# EAGLE schematic Tapuino 1.5 (EAGLE 7.1.0)
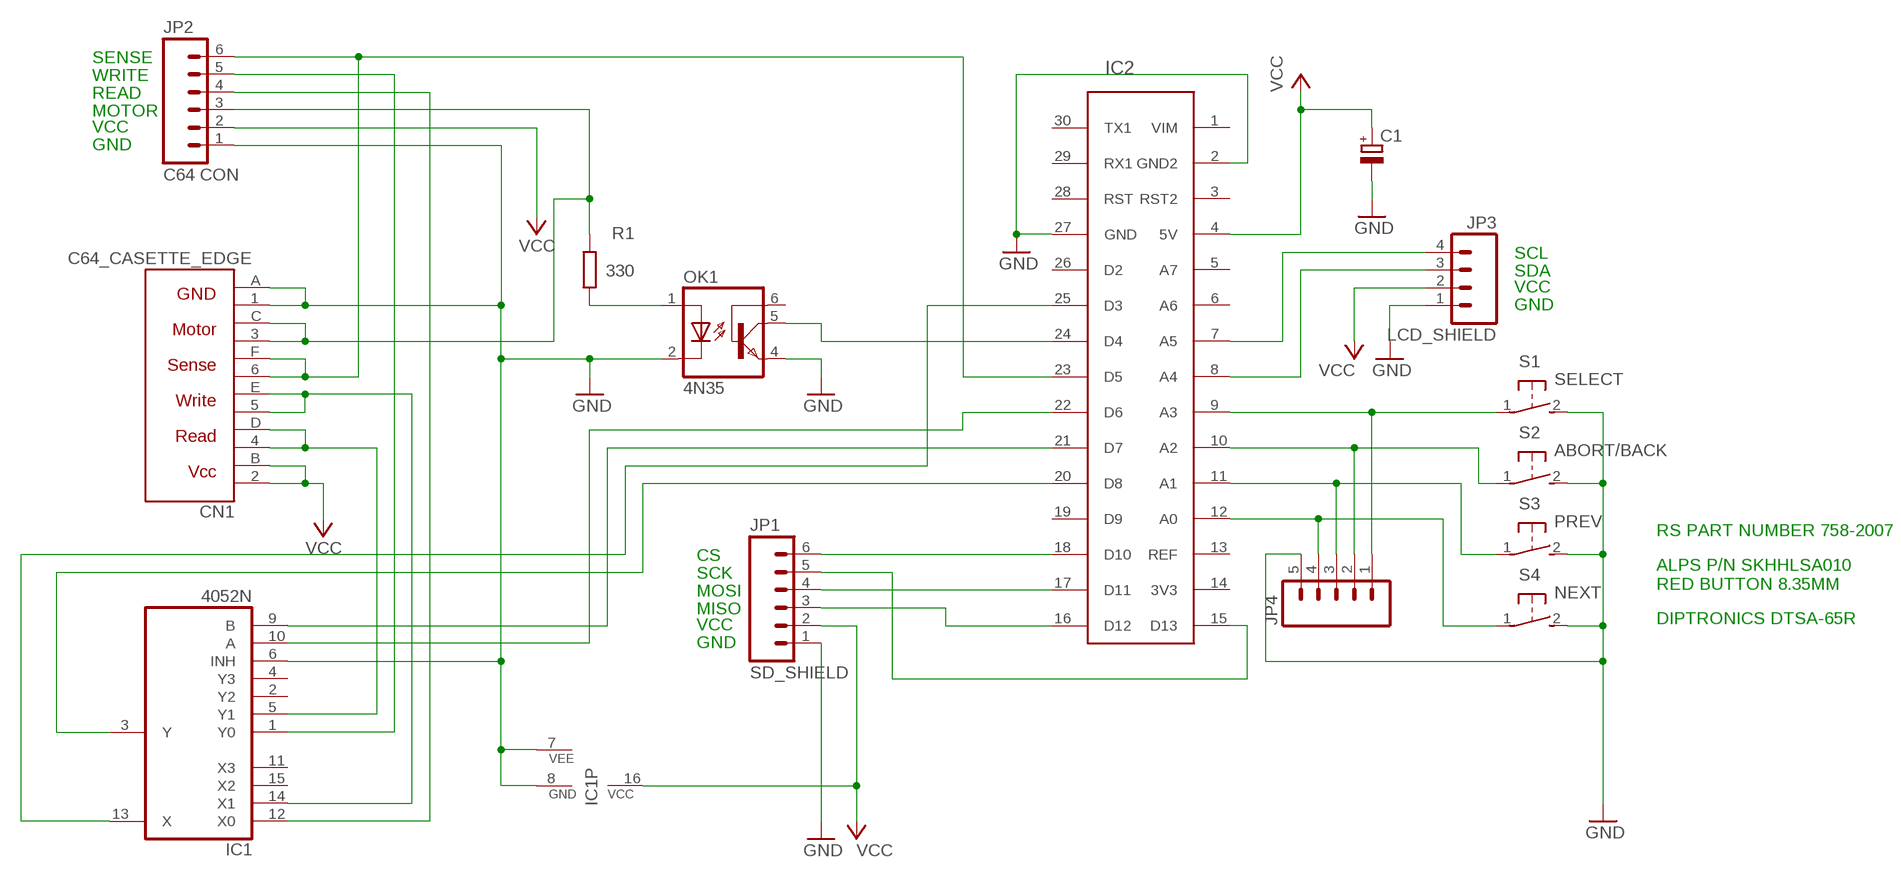
[diagram p0: schematic, sheet 1]

## Parts
C1  CPOL-EUE2.5-6  [E2,5-6]
CN1  C64_CASETTE_EDGE  [C64_CASSETTE]
IC1  4052N  [DIL16]
IC2  ARDUINO_NANO_V3  [NANO_V3]
JP1  SD_SHIELD  M06LOCK_LONGPADS  [1X06_LOCK_LONGPADS]
JP2  C64 CON  M06LOCK_LONGPADS  [1X06_LOCK_LONGPADS]
JP3  LCD_SHIELD  M04LOCK_LONGPADS  [1X04_LOCK_LONGPADS]
JP4  M05LOCK_LONGPADS  [1X05_LOCK_LONGPADS]
OK1  4N35  [DIL06]
R1  330  R-EU_0207/10  [0207/10]
S1  SELECT  31-XX  [B3F-31XX]
S2  ABORT/BACK  31-XX  [B3F-31XX]
S3  PREV  31-XX  [B3F-31XX]
S4  NEXT  31-XX  [B3F-31XX]

## Nets
GND [GND]: C1.- CN1.1(GND1) CN1.A(GND2) IC1.6(INH) IC1.7(VEE) IC1.8(GND) IC2.2(GND2) IC2.27(GND) JP1.1 JP2.1 JP3.1 JP4.5 OK1.2(C) OK1.4(EMI) S1.2(S) S2.2(S) S3.2(S) S4.2(S)
N$1: IC2.16(D12) JP1.3
N$2: IC2.18(D10) JP1.6
N$3: IC2.15(D13) JP1.5
N$4: IC2.17(D11) JP1.4
N$5: IC2.7(A5) JP3.4
N$6: IC2.8(A4) JP3.3
N$7: IC2.9(A3) JP4.1 S1.1(P)
N$8: OK1.1(A) R1.1
N$9: IC2.12(A0) JP4.4 S4.1(P)
N$10: IC2.24(D4) OK1.5(COL)
N$11: IC2.11(A1) JP4.3 S3.1(P)
N$13: IC1.1(Y0) JP2.5
N$14: CN1.3(MOTOR1) CN1.C(MOTOR2) JP2.3 R1.2
N$15: IC1.3(Y) IC2.20(D8)
N$16: IC1.12(X0) JP2.4
N$17: CN1.6(SENSE1) CN1.F(SENSE2) IC2.23(D5) JP2.6
N$18: IC1.13(X) IC2.25(D3)
N$19: CN1.4(READ1) CN1.D(READ2) IC1.5(Y1)
N$20: IC1.9(B) IC2.21(D7)
N$21: CN1.5(WRITE1) CN1.E(WRITE2) IC1.14(X1)
N$22: IC1.10(A) IC2.22(D6)
N$23: IC2.10(A2) JP4.2 S2.1(P)
VCC [VCC]: C1.+ CN1.2(VCC1) CN1.B(VCC2) IC1.16(VCC) IC2.4(5V) JP1.2 JP2.2 JP3.2
Unconnected: IC1.2(Y2) IC1.4(Y3) IC1.11(X3) IC1.15(X2) IC2.1(VIM) IC2.3(RST2) IC2.5(A7) IC2.6(A6) IC2.13(REF) IC2.14(3V3) IC2.19(D9) IC2.26(D2) IC2.28(RST) IC2.29(RX1) IC2.30(TX1) OK1.6(BAS)

## Notes on the sheet
- SENSE
- WRITE
- READ
- MOTOR
- VCC
- GND
- SCL
- SDA
- VCC
- GND
- RS PART NUMBER 758-2007
- CS
- SCK
- ALPS P/N SKHHLSA010
  RED BUTTON 8.35MM
- MOSI
- MISO
- VCC
- DIPTRONICS DTSA-65R
- GND

## Library data of the parts
C1 = resistor:CPOL-EU: POLARIZED CAPACITOR, European symbol
CN1 = commodore MOD:C64_CASETTE_EDGE
IC1 = 40xx:4052: Dual 4-channel ANALOG MULTIPLEXER
IC2 = arduino:ARDUINO_NANO_V3
JP1 JP2 = SparkFun:M06: Header 6 Standard 6-pin 0.1" header. Use with straight break away headers (SKU : PRT-00116), right angle break away headers (PRT-00553), swiss pins (PRT-00743), machine pins (PRT-00117), and female headers (PRT-00115). Molex polarized connector foot print use with SKU : PRT-08094 with associated crimp pins and housings. NOTES ON THE VARIANTS LOCK and LOCK_LONGPADS... This footprint was designed to help hold the alignment of a through-hole component (i.e. 6-pin header) while soldering it into place. You may notice that each hole has been shifted either up or down by 0.005 of an inch from it's more standard position (which is a perfectly straight line). This slight alteration caused the pins (the squares in the middle) to touch the edges of the holes. Because they are alternating, it causes a "brace" to hold the component in place. 0.005 has proven to be the perfect amount of "off-center" position when using our standard breakaway headers. Although looks a little odd when you look at the bare footprint, once you have a header in there, the alteration is very hard to notice. Also, if you push a header all the way into place, it is covered up entirely on the bottom side. This idea of altering the position of holes to aid alignment will be further integrated into the Sparkfun Library for other footprints. It can help hold any component with 3 or more connection pins.
JP3 = SparkFun:M04: Header 4 Standard 4-pin 0.1" header. Use with straight break away headers (SKU : PRT-00116), right angle break away headers (PRT-00553), swiss pins (PRT-00743), machine pins (PRT-00117), and female headers (PRT-00115). Molex polarized connector foot print use with SKU : PRT-08231 with associated crimp pins and housings.
JP4 = SparkFun:M05: Header 5 Standard 5-pin 0.1" header. Use with straight break away headers (SKU : PRT-00116), right angle break away headers (PRT-00553), swiss pins (PRT-00743), machine pins (PRT-00117), and female headers (PRT-00115). Molex polarized connector foot print use with SKU : PRT-08230 with associated crimp pins and housings.
OK1 = optocoupler:4N35: MOTOROLA OPTO COUPLER; MF: FAIRCHILD SEMICONDUCTOR; MPN: 4N35; OC_FARNELL: 1328375; OC_NEWARK: 72K9946
R1 = resistor:R-EU_: RESISTOR, European symbol
S1-S4 = switch-omron:31-XX: OMRON SWITCH; MPN: B3F-3100; OC_FARNELL: 959704; OC_NEWARK: 36M3582

## Net classes
0 default: width 0.254 mm, clearance 0.254 mm
1 GND: width 0.762 mm, clearance 0.381 mm
2 VCC: width 0.762 mm, clearance 0.381 mm